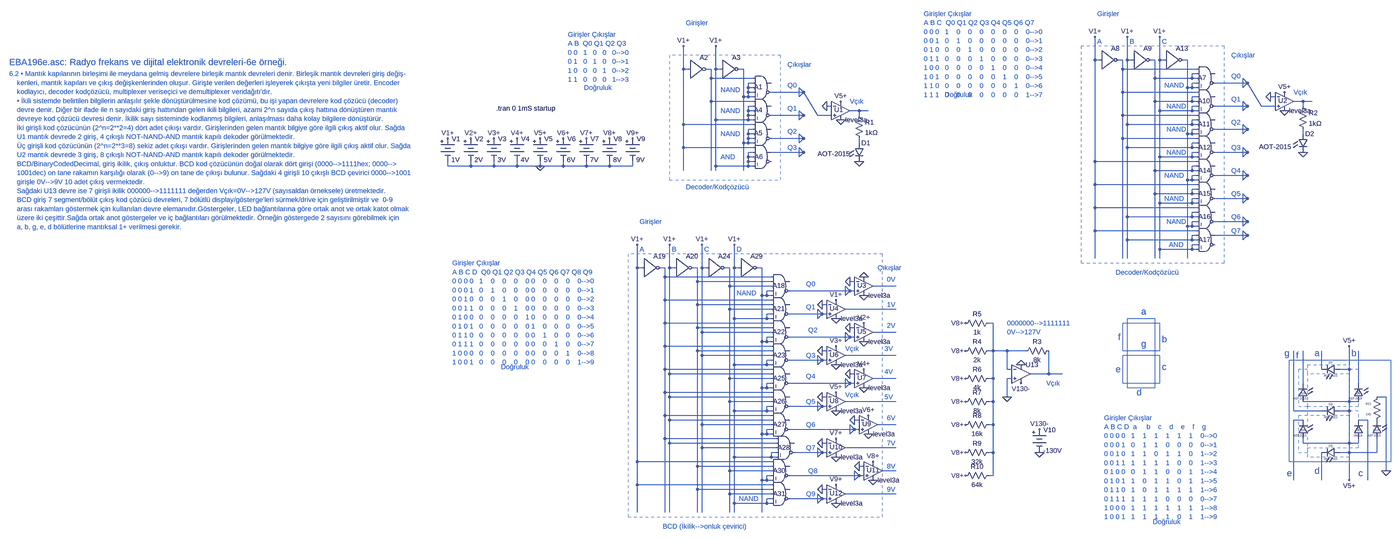
[diagram p0: schematic EBA196e.asc, whole sheet]
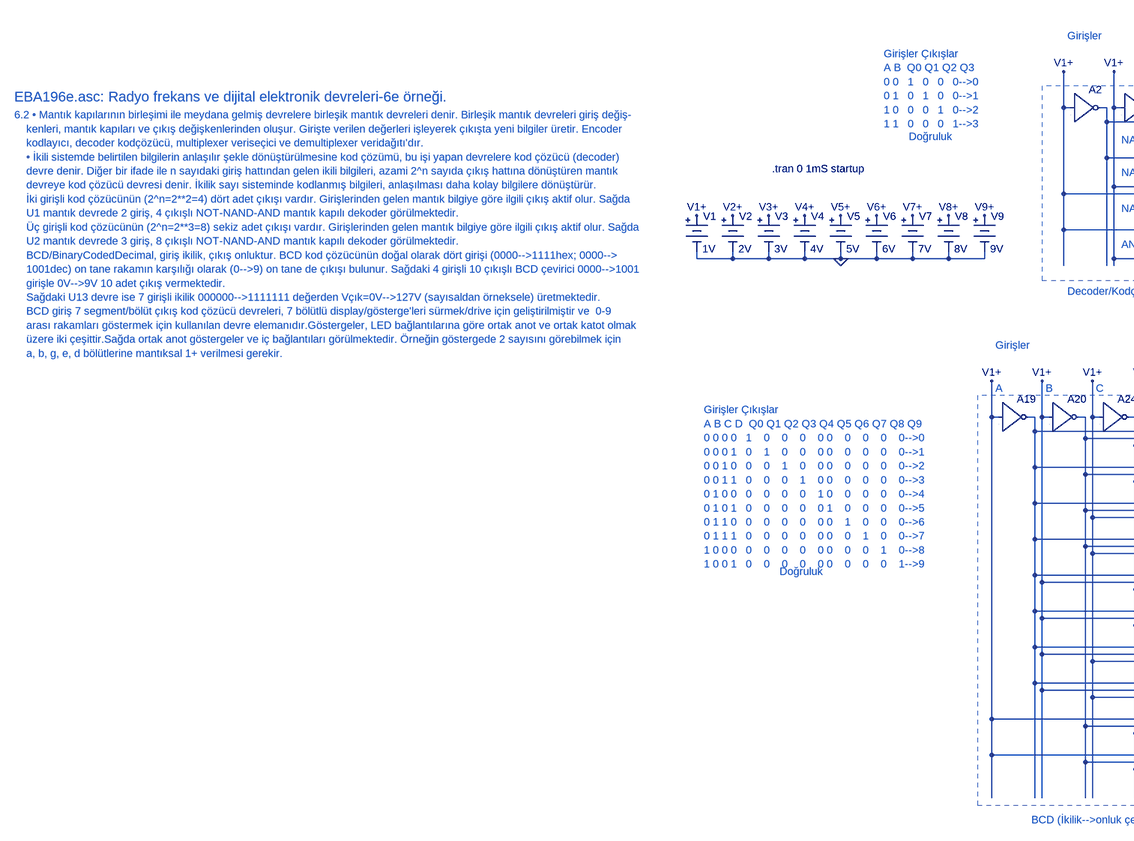
[diagram p1: schematic EBA196e.asc, part, row 1 of 1, column 1 of 2]
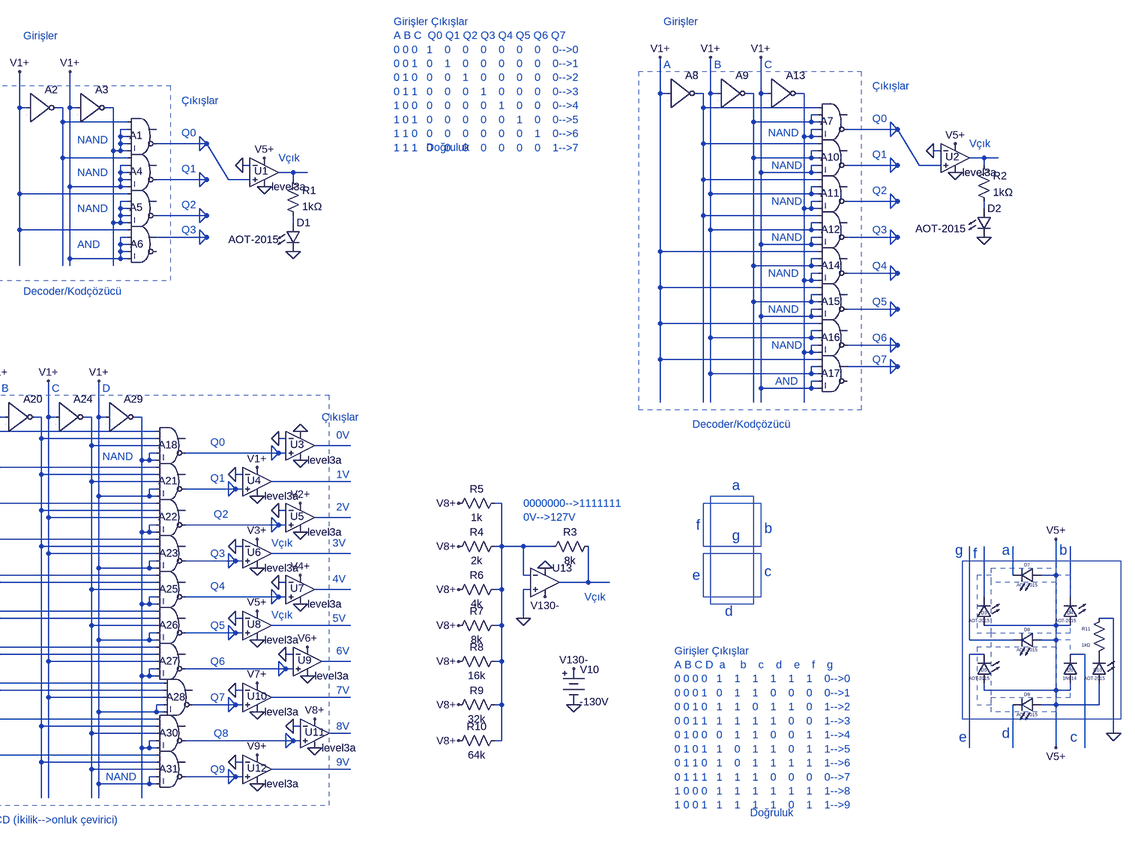
[diagram p2: schematic EBA196e.asc, part, row 1 of 1, column 2 of 2]
EBA196e.asc, the LTspice schematic file:
Version 4
SHEET 1 7064 4332
WIRE 3872 48 3872 -32
WIRE 3888 48 3872 48
WIRE 3968 48 3952 48
WIRE 3984 48 3984 -32
WIRE 4000 48 3984 48
WIRE 4080 48 4064 48
WIRE 4096 48 4096 -32
WIRE 4112 48 4096 48
WIRE 4192 48 4176 48
WIRE 2448 80 2448 0
WIRE 2464 80 2448 80
WIRE 2544 80 2528 80
WIRE 2560 80 2560 0
WIRE 2576 80 2560 80
WIRE 2656 80 2640 80
WIRE 3968 80 3968 48
WIRE 4224 80 3968 80
WIRE 4224 96 4208 96
WIRE 2544 112 2544 80
WIRE 2688 112 2544 112
WIRE 4080 112 4080 48
WIRE 4208 112 4208 96
WIRE 4208 112 4080 112
WIRE 4224 112 4208 112
WIRE 2688 128 2672 128
WIRE 4224 128 4208 128
WIRE 4400 128 4384 112
WIRE 4400 128 4288 128
WIRE 2672 144 2672 128
WIRE 2688 144 2672 144
WIRE 4192 144 4192 48
WIRE 4208 144 4208 128
WIRE 4208 144 4192 144
WIRE 4224 144 4208 144
WIRE 4384 144 4384 112
WIRE 4384 144 4400 128
WIRE 2672 160 2672 144
WIRE 2688 160 2672 160
WIRE 2864 160 2848 144
WIRE 2864 160 2752 160
WIRE 3968 160 3968 80
WIRE 4224 160 3968 160
WIRE 2656 176 2656 80
WIRE 2672 176 2672 160
WIRE 2672 176 2656 176
WIRE 2688 176 2672 176
WIRE 2848 176 2848 144
WIRE 2848 176 2864 160
WIRE 4224 176 4208 176
WIRE 4496 176 4480 176
WIRE 2544 192 2544 112
WIRE 2688 192 2544 192
WIRE 4080 192 4080 112
WIRE 4208 192 4208 176
WIRE 4208 192 4080 192
WIRE 4224 192 4208 192
WIRE 4592 192 4560 192
WIRE 4624 192 4592 192
WIRE 2688 208 2672 208
WIRE 2960 208 2944 208
WIRE 4224 208 4208 208
WIRE 4400 208 4384 192
WIRE 4400 208 4288 208
WIRE 4448 208 4400 128
WIRE 4496 208 4448 208
WIRE 4592 208 4592 192
WIRE 2672 224 2672 208
WIRE 2688 224 2672 224
WIRE 3056 224 3024 224
WIRE 3088 224 3056 224
WIRE 4096 224 4096 48
WIRE 4208 224 4208 208
WIRE 4208 224 4096 224
WIRE 4224 224 4208 224
WIRE 4384 224 4384 192
WIRE 4384 224 4400 208
WIRE 2672 240 2672 224
WIRE 2688 240 2672 240
WIRE 2864 240 2848 224
WIRE 2864 240 2752 240
WIRE 2912 240 2864 160
WIRE 2960 240 2912 240
WIRE 3056 240 3056 224
WIRE 3968 240 3968 160
WIRE 4224 240 3968 240
WIRE 2560 256 2560 80
WIRE 2672 256 2672 240
WIRE 2672 256 2560 256
WIRE 2688 256 2672 256
WIRE 2848 256 2848 224
WIRE 2848 256 2864 240
WIRE 4224 256 4208 256
WIRE 2448 272 2448 80
WIRE 2688 272 2448 272
WIRE 3984 272 3984 48
WIRE 4208 272 4208 256
WIRE 4208 272 3984 272
WIRE 4224 272 4208 272
WIRE 2688 288 2672 288
WIRE 4224 288 4208 288
WIRE 4400 288 4384 272
WIRE 4400 288 4288 288
WIRE 2672 304 2672 288
WIRE 2688 304 2672 304
WIRE 4192 304 4192 144
WIRE 4208 304 4208 288
WIRE 4208 304 4192 304
WIRE 4224 304 4208 304
WIRE 4384 304 4384 272
WIRE 4384 304 4400 288
WIRE 4592 304 4592 288
WIRE 2672 320 2672 304
WIRE 2688 320 2672 320
WIRE 2864 320 2848 304
WIRE 2864 320 2752 320
WIRE 3968 320 3968 240
WIRE 4224 320 3968 320
WIRE 2656 336 2656 176
WIRE 2672 336 2672 320
WIRE 2672 336 2656 336
WIRE 2688 336 2672 336
WIRE 2848 336 2848 304
WIRE 2848 336 2864 320
WIRE 3056 336 3056 320
WIRE 4224 336 4208 336
WIRE 2448 352 2448 272
WIRE 2688 352 2448 352
WIRE 3984 352 3984 272
WIRE 4208 352 4208 336
WIRE 4208 352 3984 352
WIRE 4224 352 4208 352
WIRE 2688 368 2672 368
WIRE 2864 368 2848 352
WIRE 2864 368 2752 368
WIRE 4224 368 4208 368
WIRE 4400 368 4384 352
WIRE 4400 368 4288 368
WIRE 2672 384 2672 368
WIRE 2688 384 2672 384
WIRE 2848 384 2848 352
WIRE 2848 384 2864 368
WIRE 4096 384 4096 224
WIRE 4208 384 4208 368
WIRE 4208 384 4096 384
WIRE 4224 384 4208 384
WIRE 4384 384 4384 352
WIRE 4384 384 4400 368
WIRE 2672 400 2672 384
WIRE 2688 400 2672 400
WIRE 3872 400 3872 48
WIRE 4224 400 3872 400
WIRE 1632 416 1632 400
WIRE 1712 416 1712 400
WIRE 1712 416 1632 416
WIRE 1792 416 1792 400
WIRE 1792 416 1712 416
WIRE 1872 416 1872 400
WIRE 1872 416 1792 416
WIRE 1952 416 1952 400
WIRE 1952 416 1872 416
WIRE 2032 416 2032 400
WIRE 2032 416 1952 416
WIRE 2112 416 2112 400
WIRE 2112 416 2032 416
WIRE 2192 416 2192 400
WIRE 2192 416 2112 416
WIRE 2272 416 2272 400
WIRE 2272 416 2192 416
WIRE 2560 416 2560 256
WIRE 2672 416 2672 400
WIRE 2672 416 2560 416
WIRE 2688 416 2672 416
WIRE 4224 416 4208 416
WIRE 2448 432 2448 352
WIRE 2544 432 2544 192
WIRE 2560 432 2560 416
WIRE 2656 432 2656 336
WIRE 4080 432 4080 192
WIRE 4208 432 4208 416
WIRE 4208 432 4080 432
WIRE 4224 432 4208 432
WIRE 4224 448 4208 448
WIRE 4400 448 4384 432
WIRE 4400 448 4288 448
WIRE 4192 464 4192 304
WIRE 4208 464 4208 448
WIRE 4208 464 4192 464
WIRE 4224 464 4208 464
WIRE 4384 464 4384 432
WIRE 4384 464 4400 448
WIRE 3872 480 3872 400
WIRE 4224 480 3872 480
WIRE 4224 496 4208 496
WIRE 4080 512 4080 432
WIRE 4208 512 4208 496
WIRE 4208 512 4080 512
WIRE 4224 512 4208 512
WIRE 4224 528 4208 528
WIRE 4400 528 4384 512
WIRE 4400 528 4288 528
WIRE 4096 544 4096 384
WIRE 4208 544 4208 528
WIRE 4208 544 4096 544
WIRE 4224 544 4208 544
WIRE 4384 544 4384 512
WIRE 4384 544 4400 528
WIRE 3872 560 3872 480
WIRE 4224 560 3872 560
WIRE 4224 576 4208 576
WIRE 3984 592 3984 352
WIRE 4208 592 4208 576
WIRE 4208 592 3984 592
WIRE 4224 592 4208 592
WIRE 4224 608 4208 608
WIRE 4400 608 4384 592
WIRE 4400 608 4288 608
WIRE 4192 624 4192 464
WIRE 4208 624 4208 608
WIRE 4208 624 4192 624
WIRE 4224 624 4208 624
WIRE 4384 624 4384 592
WIRE 4384 624 4400 608
WIRE 3872 640 3872 560
WIRE 4224 640 3872 640
WIRE 4224 656 4208 656
WIRE 4400 656 4384 640
WIRE 4400 656 4288 656
WIRE 3984 672 3984 592
WIRE 4208 672 4208 656
WIRE 4208 672 3984 672
WIRE 4224 672 4208 672
WIRE 4384 672 4384 640
WIRE 4384 672 4400 656
WIRE 4224 688 4208 688
WIRE 4096 704 4096 544
WIRE 4208 704 4208 688
WIRE 4208 704 4096 704
WIRE 4224 704 4208 704
WIRE 3872 736 3872 640
WIRE 3968 736 3968 320
WIRE 3984 736 3984 672
WIRE 4080 736 4080 512
WIRE 4096 736 4096 704
WIRE 4192 736 4192 624
WIRE 2288 768 2288 688
WIRE 2304 768 2288 768
WIRE 2384 768 2368 768
WIRE 2400 768 2400 688
WIRE 2416 768 2400 768
WIRE 2496 768 2480 768
WIRE 2512 768 2512 688
WIRE 2528 768 2512 768
WIRE 2608 768 2592 768
WIRE 2624 768 2624 688
WIRE 2640 768 2624 768
WIRE 2720 768 2704 768
WIRE 2384 800 2384 768
WIRE 2752 800 2384 800
WIRE 2496 816 2496 768
WIRE 2752 816 2496 816
WIRE 3040 816 3024 816
WIRE 2608 832 2608 768
WIRE 2752 832 2608 832
WIRE 3184 832 3104 832
WIRE 2752 848 2736 848
WIRE 3024 848 3008 832
WIRE 3024 848 2816 848
WIRE 3040 848 3024 848
WIRE 2720 864 2720 768
WIRE 2736 864 2736 848
WIRE 2736 864 2720 864
WIRE 2752 864 2736 864
WIRE 3008 864 3008 832
WIRE 3008 864 3024 848
WIRE 2384 880 2384 800
WIRE 2752 880 2384 880
WIRE 2496 896 2496 816
WIRE 2752 896 2496 896
WIRE 2944 896 2928 896
WIRE 2608 912 2608 832
WIRE 2752 912 2608 912
WIRE 3184 912 3008 912
WIRE 2752 928 2736 928
WIRE 2928 928 2912 912
WIRE 2928 928 2816 928
WIRE 2944 928 2928 928
WIRE 2624 944 2624 768
WIRE 2736 944 2736 928
WIRE 2736 944 2624 944
WIRE 2752 944 2736 944
WIRE 2912 944 2912 912
WIRE 2912 944 2928 928
WIRE 2384 960 2384 880
WIRE 2752 960 2384 960
WIRE 3520 960 3504 960
WIRE 2496 976 2496 896
WIRE 2752 976 2496 976
WIRE 3040 976 3024 976
WIRE 2512 992 2512 768
WIRE 2752 992 2512 992
WIRE 3184 992 3104 992
WIRE 2752 1008 2736 1008
WIRE 3024 1008 3008 992
WIRE 3024 1008 2816 1008
WIRE 3040 1008 3024 1008
WIRE 2720 1024 2720 864
WIRE 2736 1024 2736 1008
WIRE 2736 1024 2720 1024
WIRE 2752 1024 2736 1024
WIRE 3008 1024 3008 992
WIRE 3008 1024 3024 1008
WIRE 2384 1040 2384 960
WIRE 2752 1040 2384 1040
WIRE 2496 1056 2496 976
WIRE 2752 1056 2496 1056
WIRE 2944 1056 2928 1056
WIRE 3520 1056 3520 960
WIRE 3520 1056 3504 1056
WIRE 3568 1056 3520 1056
WIRE 3632 1056 3568 1056
WIRE 2512 1072 2512 992
WIRE 2752 1072 2512 1072
WIRE 3184 1072 3008 1072
WIRE 2752 1088 2736 1088
WIRE 2928 1088 2912 1072
WIRE 2928 1088 2816 1088
WIRE 2944 1088 2928 1088
WIRE 2624 1104 2624 944
WIRE 2736 1104 2736 1088
WIRE 2736 1104 2624 1104
WIRE 2752 1104 2736 1104
WIRE 2912 1104 2912 1072
WIRE 2912 1104 2928 1088
WIRE 2384 1120 2384 1040
WIRE 2752 1120 2384 1120
WIRE 3568 1120 3568 1056
WIRE 3584 1120 3568 1120
WIRE 4656 1120 4656 1056
WIRE 4752 1120 4752 1040
WIRE 4752 1120 4720 1120
WIRE 2400 1136 2400 768
WIRE 2752 1136 2400 1136
WIRE 3040 1136 3024 1136
WIRE 3712 1136 3712 1056
WIRE 3712 1136 3648 1136
WIRE 3760 1136 3712 1136
WIRE 2608 1152 2608 912
WIRE 2752 1152 2608 1152
WIRE 3184 1152 3104 1152
WIRE 3520 1152 3520 1056
WIRE 3520 1152 3504 1152
WIRE 3584 1152 3568 1152
WIRE 2752 1168 2736 1168
WIRE 3024 1168 3008 1152
WIRE 3024 1168 2816 1168
WIRE 3040 1168 3024 1168
WIRE 4592 1168 4592 1056
WIRE 4784 1168 4784 1056
WIRE 2720 1184 2720 1024
WIRE 2736 1184 2736 1168
WIRE 2736 1184 2720 1184
WIRE 2752 1184 2736 1184
WIRE 3008 1184 3008 1152
WIRE 3008 1184 3024 1168
WIRE 2384 1200 2384 1120
WIRE 2752 1200 2384 1200
WIRE 2400 1216 2400 1136
WIRE 2752 1216 2400 1216
WIRE 2944 1216 2928 1216
WIRE 3568 1216 3568 1152
WIRE 4880 1216 4848 1216
WIRE 2608 1232 2608 1152
WIRE 2752 1232 2608 1232
WIRE 3184 1232 3008 1232
WIRE 3520 1232 3520 1152
WIRE 3520 1232 3504 1232
WIRE 4752 1232 4752 1120
WIRE 4752 1232 4592 1232
WIRE 4784 1232 4752 1232
WIRE 2752 1248 2736 1248
WIRE 2928 1248 2912 1232
WIRE 2928 1248 2816 1248
WIRE 2944 1248 2928 1248
WIRE 2624 1264 2624 1104
WIRE 2736 1264 2736 1248
WIRE 2736 1264 2624 1264
WIRE 2752 1264 2736 1264
WIRE 2912 1264 2912 1232
WIRE 2912 1264 2928 1248
WIRE 4560 1264 4560 1056
WIRE 4656 1264 4560 1264
WIRE 4752 1264 4752 1232
WIRE 4752 1264 4720 1264
WIRE 2384 1280 2384 1200
WIRE 2752 1280 2384 1280
WIRE 2400 1296 2400 1216
WIRE 2752 1296 2400 1296
WIRE 3056 1296 3040 1296
WIRE 4592 1296 4560 1296
WIRE 4816 1296 4784 1296
WIRE 2512 1312 2512 1072
WIRE 2752 1312 2512 1312
WIRE 3184 1312 3120 1312
WIRE 3520 1312 3520 1232
WIRE 3520 1312 3504 1312
WIRE 2752 1328 2736 1328
WIRE 3040 1328 3024 1312
WIRE 3040 1328 2816 1328
WIRE 3056 1328 3040 1328
WIRE 2720 1344 2720 1184
WIRE 2736 1344 2736 1328
WIRE 2736 1344 2720 1344
WIRE 2752 1344 2736 1344
WIRE 3024 1344 3024 1312
WIRE 3024 1344 3040 1328
WIRE 2384 1360 2384 1280
WIRE 2768 1360 2384 1360
WIRE 2400 1376 2400 1296
WIRE 2768 1376 2400 1376
WIRE 2944 1376 2928 1376
WIRE 4592 1376 4592 1360
WIRE 4752 1376 4752 1264
WIRE 4752 1376 4592 1376
WIRE 4784 1376 4784 1360
WIRE 4784 1376 4752 1376
WIRE 2512 1392 2512 1312
WIRE 2768 1392 2512 1392
WIRE 3184 1392 3008 1392
WIRE 2768 1408 2752 1408
WIRE 2928 1408 2912 1392
WIRE 2928 1408 2832 1408
WIRE 2944 1408 2928 1408
WIRE 3520 1408 3520 1312
WIRE 3520 1408 3504 1408
WIRE 4752 1408 4752 1376
WIRE 4752 1408 4720 1408
WIRE 4848 1408 4848 1360
WIRE 4848 1408 4752 1408
WIRE 2624 1424 2624 1264
WIRE 2752 1424 2752 1408
WIRE 2752 1424 2624 1424
WIRE 2768 1424 2752 1424
WIRE 2912 1424 2912 1392
WIRE 2912 1424 2928 1408
WIRE 2288 1440 2288 768
WIRE 2752 1440 2288 1440
WIRE 2496 1456 2496 1056
WIRE 2752 1456 2496 1456
WIRE 3072 1456 3056 1456
WIRE 2608 1472 2608 1232
WIRE 2752 1472 2608 1472
WIRE 3184 1472 3136 1472
WIRE 4880 1472 4880 1216
WIRE 2752 1488 2736 1488
WIRE 3056 1488 3040 1472
WIRE 3056 1488 2816 1488
WIRE 3072 1488 3056 1488
WIRE 3520 1488 3520 1408
WIRE 3520 1488 3504 1488
WIRE 2720 1504 2720 1344
WIRE 2736 1504 2736 1488
WIRE 2736 1504 2720 1504
WIRE 2752 1504 2736 1504
WIRE 3040 1504 3040 1472
WIRE 3040 1504 3056 1488
WIRE 4560 1504 4560 1296
WIRE 4656 1504 4656 1408
WIRE 4752 1504 4752 1408
WIRE 4816 1504 4816 1296
WIRE 2288 1520 2288 1440
WIRE 2752 1520 2288 1520
WIRE 2496 1536 2496 1456
WIRE 2752 1536 2496 1536
WIRE 2944 1536 2928 1536
WIRE 2608 1552 2608 1472
WIRE 2752 1552 2608 1552
WIRE 3184 1552 3008 1552
WIRE 2752 1568 2736 1568
WIRE 2928 1568 2912 1552
WIRE 2928 1568 2816 1568
WIRE 2944 1568 2928 1568
WIRE 2624 1584 2624 1424
WIRE 2736 1584 2736 1568
WIRE 2736 1584 2624 1584
WIRE 2752 1584 2736 1584
WIRE 2912 1584 2912 1552
WIRE 2912 1584 2928 1568
WIRE 2288 1616 2288 1520
WIRE 2384 1616 2384 1360
WIRE 2400 1616 2400 1376
WIRE 2496 1616 2496 1536
WIRE 2512 1616 2512 1392
WIRE 2608 1616 2608 1552
WIRE 2624 1616 2624 1584
WIRE 2720 1616 2720 1504
FLAG 2448 0 V1+
FLAG 2560 0 V1+
FLAG 2944 208 0
FLAG 2992 192 V5+
FLAG 2992 256 0
FLAG 3056 400 0
FLAG 3872 -32 V1+
FLAG 3984 -32 V1+
FLAG 4480 176 0
FLAG 4528 160 V5+
FLAG 4528 224 0
FLAG 4592 368 0
FLAG 4096 -32 V1+
FLAG 2288 688 V1+
FLAG 2400 688 V1+
FLAG 3024 816 0
FLAG 3072 864 0
FLAG 2512 688 V1+
FLAG 2624 688 V1+
FLAG 1632 320 V1+
FLAG 1712 320 V2+
FLAG 1792 320 V3+
FLAG 1872 320 V4+
FLAG 1952 320 V5+
FLAG 2032 320 V6+
FLAG 2112 320 V7+
FLAG 2192 320 V8+
FLAG 2272 320 V9+
FLAG 1952 416 0
FLAG 2928 896 0
FLAG 2976 944 0
FLAG 3024 976 0
FLAG 3072 1024 0
FLAG 2928 1056 0
FLAG 2976 1104 0
FLAG 3024 1136 0
FLAG 3072 1184 0
FLAG 2928 1216 0
FLAG 2976 1264 0
FLAG 3040 1296 0
FLAG 3088 1344 0
FLAG 2928 1376 0
FLAG 2976 1424 0
FLAG 3056 1456 0
FLAG 3104 1504 0
FLAG 2928 1536 0
FLAG 2976 1584 0
FLAG 3072 800 0
FLAG 2976 880 V1+
FLAG 3072 960 V2+
FLAG 2976 1040 V3+
FLAG 3072 1120 V4+
FLAG 2976 1200 V5+
FLAG 3088 1280 V6+
FLAG 2976 1360 V7+
FLAG 3104 1440 V8+
FLAG 2976 1520 V9+
FLAG 3568 1216 0
FLAG 3424 960 V8+
FLAG 3424 1056 V8+
FLAG 3424 1152 V8+
FLAG 3424 1232 V8+
FLAG 3424 1312 V8+
FLAG 3424 1408 V8+
FLAG 3424 1488 V8+
FLAG 3616 1104 0
FLAG 3680 1328 V130-
FLAG 3680 1408 0
FLAG 3616 1168 V130-
FLAG 4752 1040 V5+
FLAG 4752 1504 V5+
FLAG 4880 1472 0
SYMBOL Digital\\and 2720 80 R0
WINDOW 0 -28 62 Left 2
SYMATTR InstName A1
SYMBOL Digital\\inv 2464 16 R0
SYMATTR InstName A2
SYMBOL Digital\\inv 2576 16 R0
SYMATTR InstName A3
SYMBOL Digital\\and 2720 160 R0
WINDOW 0 -28 62 Left 2
SYMATTR InstName A4
SYMBOL Digital\\and 2720 240 R0
WINDOW 0 -28 62 Left 2
SYMATTR InstName A5
SYMBOL Digital\\and 2720 320 R0
WINDOW 0 -26 63 Left 2
SYMATTR InstName A6
SYMBOL OpAmps\\UniversalOpAmp3 2992 224 R0
WINDOW 0 -22 -3 Left 2
SYMATTR InstName U1
SYMBOL LED 3040 336 R0
WINDOW 3 -128 37 Left 2
SYMATTR Value AOT-2015
SYMATTR InstName D1
SYMATTR Description Diode
SYMATTR Type diode
SYMBOL res 3040 224 R0
SYMATTR InstName R1
SYMATTR Value 1kΩ
SYMBOL Digital\\and 4256 48 R0
WINDOW 0 -28 62 Left 2
SYMATTR InstName A7
SYMBOL Digital\\inv 3888 -16 R0
SYMATTR InstName A8
SYMBOL Digital\\inv 4000 -16 R0
SYMATTR InstName A9
SYMBOL Digital\\and 4256 128 R0
WINDOW 0 -28 62 Left 2
SYMATTR InstName A10
SYMBOL Digital\\and 4256 208 R0
WINDOW 0 -28 62 Left 2
SYMATTR InstName A11
SYMBOL Digital\\and 4256 288 R0
WINDOW 0 -26 63 Left 2
SYMATTR InstName A12
SYMBOL OpAmps\\UniversalOpAmp3 4528 192 R0
WINDOW 0 -22 -3 Left 2
SYMATTR InstName U2
SYMBOL LED 4576 304 R0
WINDOW 3 -136 45 Left 2
SYMATTR Value AOT-2015
SYMATTR InstName D2
SYMATTR Description Diode
SYMATTR Type diode
SYMBOL res 4576 192 R0
SYMATTR InstName R2
SYMATTR Value 1kΩ
SYMBOL Digital\\inv 4112 -16 R0
SYMATTR InstName A13
SYMBOL Digital\\and 4256 368 R0
WINDOW 0 -26 63 Left 2
SYMATTR InstName A14
SYMBOL Digital\\and 4256 448 R0
WINDOW 0 -26 63 Left 2
SYMATTR InstName A15
SYMBOL Digital\\and 4256 528 R0
WINDOW 0 -26 63 Left 2
SYMATTR InstName A16
SYMBOL Digital\\and 4256 608 R0
WINDOW 0 -26 63 Left 2
SYMATTR InstName A17
SYMBOL Digital\\and 2784 768 R0
WINDOW 0 -28 62 Left 2
SYMATTR InstName A18
SYMBOL Digital\\inv 2304 704 R0
SYMATTR InstName A19
SYMBOL Digital\\inv 2416 704 R0
SYMATTR InstName A20
SYMBOL Digital\\and 2784 848 R0
WINDOW 0 -28 62 Left 2
SYMATTR InstName A21
SYMBOL Digital\\and 2784 928 R0
WINDOW 0 -28 62 Left 2
SYMATTR InstName A22
SYMBOL Digital\\and 2784 1008 R0
WINDOW 0 -26 63 Left 2
SYMATTR InstName A23
SYMBOL OpAmps\\UniversalOpAmp3 3072 832 R0
WINDOW 0 -22 -3 Left 2
SYMATTR InstName U3
SYMBOL Digital\\inv 2528 704 R0
SYMATTR InstName A24
SYMBOL Digital\\and 2784 1088 R0
WINDOW 0 -26 63 Left 2
SYMATTR InstName A25
SYMBOL Digital\\and 2784 1168 R0
WINDOW 0 -26 63 Left 2
SYMATTR InstName A26
SYMBOL Digital\\and 2784 1248 R0
WINDOW 0 -26 63 Left 2
SYMATTR InstName A27
SYMBOL Digital\\and 2800 1328 R0
WINDOW 0 -26 63 Left 2
SYMATTR InstName A28
SYMBOL Digital\\inv 2640 704 R0
SYMATTR InstName A29
SYMBOL Digital\\and 2784 1408 R0
WINDOW 0 -26 63 Left 2
SYMATTR InstName A30
SYMBOL Digital\\and 2784 1488 R0
WINDOW 0 -26 63 Left 2
SYMATTR InstName A31
SYMBOL Misc\\battery 1632 304 R0
WINDOW 0 14 18 Left 2
WINDOW 3 13 90 Left 2
SYMATTR InstName V1
SYMATTR Value 1V
SYMBOL Misc\\battery 1712 304 R0
WINDOW 0 14 18 Left 2
WINDOW 3 13 90 Left 2
WINDOW 123 0 0 Left 0
WINDOW 39 0 0 Left 0
SYMATTR InstName V2
SYMATTR Value 2V
SYMBOL Misc\\battery 1792 304 R0
WINDOW 0 14 18 Left 2
WINDOW 3 13 90 Left 2
SYMATTR InstName V3
SYMATTR Value 3V
SYMBOL Misc\\battery 1872 304 R0
WINDOW 0 14 18 Left 2
WINDOW 3 13 90 Left 2
SYMATTR InstName V4
SYMATTR Value 4V
SYMBOL Misc\\battery 1952 304 R0
WINDOW 0 14 18 Left 2
WINDOW 3 13 90 Left 2
SYMATTR InstName V5
SYMATTR Value 5V
SYMBOL Misc\\battery 2032 304 R0
WINDOW 0 14 18 Left 2
WINDOW 3 13 90 Left 2
SYMATTR InstName V6
SYMATTR Value 6V
SYMBOL Misc\\battery 2112 304 R0
WINDOW 0 14 18 Left 2
WINDOW 3 13 90 Left 2
SYMATTR InstName V7
SYMATTR Value 7V
SYMBOL Misc\\battery 2192 304 R0
WINDOW 0 14 18 Left 2
WINDOW 3 13 90 Left 2
SYMATTR InstName V8
SYMATTR Value 8V
SYMBOL Misc\\battery 2272 304 R0
WINDOW 0 14 18 Left 2
WINDOW 3 13 90 Left 2
SYMATTR InstName V9
SYMATTR Value 9V
SYMBOL OpAmps\\UniversalOpAmp3 2976 912 R0
WINDOW 0 -22 -3 Left 2
SYMATTR InstName U4
SYMBOL OpAmps\\UniversalOpAmp3 3072 992 R0
WINDOW 0 -22 -3 Left 2
SYMATTR InstName U5
SYMBOL OpAmps\\UniversalOpAmp3 2976 1072 R0
WINDOW 0 -22 -3 Left 2
SYMATTR InstName U6
SYMBOL OpAmps\\UniversalOpAmp3 3072 1152 R0
WINDOW 0 -22 -3 Left 2
SYMATTR InstName U7
SYMBOL OpAmps\\UniversalOpAmp3 2976 1232 R0
WINDOW 0 -22 -3 Left 2
SYMATTR InstName U8
SYMBOL OpAmps\\UniversalOpAmp3 3088 1312 R0
WINDOW 0 -22 -3 Left 2
SYMATTR InstName U9
SYMBOL OpAmps\\UniversalOpAmp3 2976 1392 R0
WINDOW 0 -22 -3 Left 2
SYMATTR InstName U10
SYMBOL OpAmps\\UniversalOpAmp3 3104 1472 R0
WINDOW 0 -22 -3 Left 2
SYMATTR InstName U11
SYMBOL OpAmps\\UniversalOpAmp3 2976 1552 R0
WINDOW 0 -22 -3 Left 2
SYMATTR InstName U12
SYMBOL res 3728 1040 R90
WINDOW 0 0 56 VBottom 2
WINDOW 3 32 56 VTop 2
SYMATTR InstName R3
SYMATTR Value 8k
SYMBOL res 3520 1040 R90
WINDOW 0 0 56 VBottom 2
WINDOW 3 32 56 VTop 2
SYMATTR InstName R4
SYMATTR Value 2k
SYMBOL res 3520 944 R90
WINDOW 0 0 56 VBottom 2
WINDOW 3 32 56 VTop 2
SYMATTR InstName R5
SYMATTR Value 1k
SYMBOL res 3520 1136 R90
WINDOW 0 0 56 VBottom 2
WINDOW 3 32 56 VTop 2
SYMATTR InstName R6
SYMATTR Value 4k
SYMBOL Opamps\\UniversalOpamp2 3616 1136 R0
SYMATTR InstName U13
SYMBOL res 3520 1216 R90
WINDOW 0 0 56 VBottom 2
WINDOW 3 32 56 VTop 2
SYMATTR InstName R7
SYMATTR Value 8k
SYMBOL res 3520 1296 R90
WINDOW 0 0 56 VBottom 2
WINDOW 3 32 56 VTop 2
SYMATTR InstName R8
SYMATTR Value 16k
SYMBOL res 3520 1392 R90
WINDOW 0 0 56 VBottom 2
WINDOW 3 32 56 VTop 2
SYMATTR InstName R9
SYMATTR Value 32k
SYMBOL res 3520 1472 R90
WINDOW 0 0 56 VBottom 2
WINDOW 3 32 56 VTop 2
SYMATTR InstName R10
SYMATTR Value 64k
SYMBOL Misc\\battery 3680 1312 R0
WINDOW 0 14 18 Left 2
WINDOW 3 13 90 Left 2
SYMATTR InstName V10
SYMATTR Value -130V
SYMBOL LED 4608 1232 R180
WINDOW 0 10 28 Left 0
WINDOW 3 3 10 Left 0
SYMATTR InstName D3
SYMATTR Value AOT-2015
SYMATTR Description Diode
SYMATTR Type diode
SYMBOL LED 4800 1232 R180
WINDOW 0 10 28 Left 0
WINDOW 3 3 10 Left 0
SYMATTR InstName D4
SYMATTR Value AOT-2015
SYMATTR Description Diode
SYMATTR Type diode
SYMBOL LED 4608 1360 R180
WINDOW 0 10 28 Left 0
WINDOW 3 3 10 Left 0
SYMATTR InstName D5
SYMATTR Value AOT-2015
SYMATTR Description Diode
SYMATTR Type diode
SYMBOL diode 4800 1360 R180
WINDOW 0 10 28 Left 0
WINDOW 3 3 10 Left 0
SYMATTR InstName D6
SYMATTR Value 1N914
SYMBOL LED 4720 1136 M270
WINDOW 0 32 32 VTop 0
WINDOW 3 0 32 VBottom 0
SYMATTR InstName D7
SYMATTR Value AOT-2015
SYMATTR Description Diode
SYMATTR Type diode
SYMBOL LED 4720 1280 M270
WINDOW 0 32 32 VTop 0
WINDOW 3 0 32 VBottom 0
SYMATTR InstName D8
SYMATTR Value AOT-2015
SYMATTR Description Diode
SYMATTR Type diode
SYMBOL LED 4720 1424 M270
WINDOW 0 32 32 VTop 0
WINDOW 3 0 32 VBottom 0
SYMATTR InstName D9
SYMATTR Value AOT-2015
SYMATTR Description Diode
SYMATTR Type diode
SYMBOL LED 4864 1360 R180
WINDOW 0 10 28 Left 0
WINDOW 3 3 10 Left 0
SYMATTR InstName D10
SYMATTR Value AOT-2015
SYMATTR Description Diode
SYMATTR Type diode
SYMBOL res 4864 1200 M0
WINDOW 0 36 40 Left 0
WINDOW 3 36 76 Left 0
SYMATTR InstName R11
SYMATTR Value 1kΩ
TEXT -232 56 Left 3 ;EBA196e.asc: Radyo frekans ve dijital elektronik devreleri-6e örneği.
TEXT -232 96 Left 2 ;6.2 • Mantık kapılarının birleşimi ile meydana gelmiş devrelere birleşik mantık devreleri denir. Birleşik mantık devreleri giriş değiş-\n    kenleri, mantık kapıları ve çıkış değişkenlerinden oluşur. Girişte verilen değerleri işleyerek çıkışta yeni bilgiler üretir. Encoder \n    kodlayıcı, decoder kodçözücü, multiplexer veriseçici ve demultiplexer veridağıtı'dır.\n    • İkili sistemde belirtilen bilgilerin anlaşılır şekle dönüştürülmesine kod çözümü, bu işi yapan devrelere kod çözücü (decoder) \n    devre denir. Diğer bir ifade ile n sayıdaki giriş hattından gelen ikili bilgileri, azami 2^n sayıda çıkış hattına dönüştüren mantık \n    devreye kod çözücü devresi denir. İkilik sayı sisteminde kodlanmış bilgileri, anlaşılması daha kolay bilgilere dönüştürür.\n    İki girişli kod çözücünün (2^n=2**2=4) dört adet çıkışı vardır. Girişlerinden gelen mantık bilgiye göre ilgili çıkış aktif olur. Sağda\n    U1 mantık devrede 2 giriş, 4 çıkışlı NOT-NAND-AND mantık kapılı dekoder görülmektedir.\n    Üç girişli kod çözücünün (2^n=2**3=8) sekiz adet çıkışı vardır. Girişlerinden gelen mantık bilgiye göre ilgili çıkış aktif olur. Sağda\n    U2 mantık devrede 3 giriş, 8 çıkışlı NOT-NAND-AND mantık kapılı dekoder görülmektedir.\n    BCD/BinaryCodedDecimal, giriş ikilik, çıkış onluktur. BCD kod çözücünün doğal olarak dört girişi (0000-->1111hex; 0000-->\n    1001dec) on tane rakamın karşılığı olarak (0-->9) on tane de çıkışı bulunur. Sağdaki 4 girişli 10 çıkışlı BCD çevirici 0000-->1001\n    girişle 0V-->9V 10 adet çıkış vermektedir.\n    Sağdaki U13 devre ise 7 girişli ikilik 000000-->1111111 değerden Vçık=0V-->127V (sayısaldan örneksele) üretmektedir.\n    BCD giriş 7 segment/bölüt çıkış kod çözücü devreleri, 7 bölütlü display/gösterge'leri sürmek/drive için geliştirilmiştir ve  0-9 \n    arası rakamları göstermek için kullanılan devre elemanıdır.Göstergeler, LED bağlantılarına göre ortak anot ve ortak katot olmak\n    üzere iki çeşittir.Sağda ortak anot göstergeler ve iç bağlantıları görülmektedir. Örneğin göstergede 2 sayısını görebilmek için \n    a, b, g, e, d bölütlerine mantıksal 1+ verilmesi gerekir.
TEXT 1800 216 Left 2 !.tran 0 1mS startup
TEXT 2048 -40 Left 2 ;Girişler Çıkışlar\nA B  Q0 Q1 Q2 Q3\n0 0   1   0   0   0-->0\n0 1   0   1   0   0-->1\n1 0   0   0   1   0-->2\n1 1   0   0   0   1-->3
TEXT 2808 296 Left 2 ;Q2
TEXT 2808 216 Left 2 ;Q1
TEXT 2808 136 Left 2 ;Q0
TEXT 2808 352 Left 2 ;Q3
TEXT 2576 152 Left 2 ;NAND
TEXT 2576 224 Left 2 ;NAND
TEXT 2576 304 Left 2 ;NAND
TEXT 2576 384 Left 2 ;AND
TEXT 2456 488 Left 2 ;Decoder/Kodçözücü
TEXT 2456 -80 Left 2 ;Girişler
TEXT 2808 64 Left 2 ;Çıkışlar
TEXT 3024 192 Left 2 ;Vçık
TEXT 3280 -112 Left 2 ;Girişler Çıkışlar\nA B C  Q0 Q1 Q2 Q3 Q4 Q5 Q6 Q7\n0 0 0   1    0    0    0    0    0    0    0-->0\n0 0 1   0    1    0    0    0    0    0    0-->1\n0 1 0   0    0    1    0    0    0    0    0-->2\n0 1 1   0    0    0    1    0    0    0    0-->3\n1 0 0   0    0    0    0    1    0    0    0-->4\n1 0 1   0    0    0    0    0    1    0    0-->5\n1 1 0   0    0    0    0    0    0    1    0-->6\n1 1 1   0    0    0    0    0    0    0    1-->7
TEXT 4344 264 Left 2 ;Q2
TEXT 4344 184 Left 2 ;Q1
TEXT 4344 104 Left 2 ;Q0
TEXT 4344 352 Left 2 ;Q3
TEXT 3944 784 Left 2 ;Decoder/Kodçözücü
TEXT 3880 -112 Left 2 ;Girişler
TEXT 4344 32 Left 2 ;Çıkışlar
TEXT 4560 160 Left 2 ;Vçık
TEXT 2104 144 Left 2 ;Doğruluk
TEXT 3352 168 Left 2 ;Doğruluk
TEXT 3880 -16 Left 2 ;A
TEXT 3992 -16 Left 2 ;B
TEXT 4104 -16 Left 2 ;C
TEXT 4344 432 Left 2 ;Q4
TEXT 4344 512 Left 2 ;Q5
TEXT 4344 592 Left 2 ;Q6
TEXT 4344 640 Left 2 ;Q7
TEXT 4112 136 Left 2 ;NAND
TEXT 4128 688 Left 2 ;AND
TEXT 4120 208 Left 2 ;NAND
TEXT 4120 288 Left 2 ;NAND
TEXT 4120 368 Left 2 ;NAND
TEXT 4112 448 Left 2 ;NAND
TEXT 4112 528 Left 2 ;NAND
TEXT 4120 608 Left 2 ;NAND
TEXT 1648 752 Left 2 ;Girişler Çıkışlar\nA B C D  Q0 Q1 Q2 Q3 Q4 Q5 Q6 Q7 Q8 Q9\n0 0 0 0   1    0    0    0    0 0    0    0    0    0-->0\n0 0 0 1   0    1    0    0    0 0    0    0    0    0-->1\n0 0 1 0   0    0    1    0    0 0    0    0    0    0-->2\n0 0 1 1   0    0    0    1    0 0    0    0    0    0-->3\n0 1 0 0   0    0    0    0    1 0    0    0    0    0-->4\n0 1 0 1   0    0    0    0    0 1    0    0    0    0-->5\n0 1 1 0   0    0    0    0    0 0    1    0    0    0-->6\n0 1 1 1   0    0    0    0    0 0    0    1    0    0-->7\n1 0 0 0   0    0    0    0    0 0    0    0    1    0-->8\n1 0 0 1   0    0    0    0    0 0    0    0    0    1-->9
TEXT 2880 984 Left 2 ;Q2
TEXT 2872 904 Left 2 ;Q1
TEXT 2872 824 Left 2 ;Q0
TEXT 2872 1072 Left 2 ;Q3
TEXT 2376 1664 Left 2 ;BCD (İkilik-->onluk çevirici)
TEXT 2296 608 Left 2 ;Girişler
TEXT 3120 768 Left 2 ;Çıkışlar
TEXT 1816 1112 Left 2 ;Doğruluk
TEXT 2296 704 Left 2 ;A
TEXT 2408 704 Left 2 ;B
TEXT 2520 704 Left 2 ;C
TEXT 2872 1144 Left 2 ;Q4
TEXT 2872 1232 Left 2 ;Q5
TEXT 2872 1312 Left 2 ;Q6
TEXT 2872 1392 Left 2 ;Q7
TEXT 2632 704 Left 2 ;D
TEXT 2632 856 Left 2 ;NAND
TEXT 2880 1472 Left 2 ;Q8
TEXT 2872 1552 Left 2 ;Q9
TEXT 3008 1048 Left 2 ;Vçık
TEXT 3008 1208 Left 2 ;Vçık
TEXT 2640 1568 Left 2 ;NAND
TEXT 3152 808 Left 2 ;0V
TEXT 3152 896 Left 2 ;1V
TEXT 3152 968 Left 2 ;2V
TEXT 3144 1048 Left 2 ;3V
TEXT 3144 1128 Left 2 ;4V
TEXT 3144 1216 Left 2 ;5V
TEXT 3152 1288 Left 2 ;6V
TEXT 3152 1376 Left 2 ;7V
TEXT 3152 1456 Left 2 ;8V
TEXT 3152 1536 Left 2 ;9V
TEXT 3704 1168 Left 2 ;Vçık
TEXT 3568 960 Left 2 ;0000000-->1111111\n0V-->127V
TEXT 4536 1480 Left 3 ;e
TEXT 4632 1472 Left 3 ;d
TEXT 4784 1480 Left 3 ;c
TEXT 4528 1064 Left 3 ;g
TEXT 4568 1072 Left 3 ;f
TEXT 4632 1064 Left 3 ;a
TEXT 4760 1064 Left 3 ;b
TEXT 4032 920 Left 3 ;a
TEXT 4104 1016 Left 3 ;b
TEXT 4104 1112 Left 3 ;c
TEXT 4016 1200 Left 3 ;d
TEXT 3944 1120 Left 3 ;e
TEXT 3952 1008 Left 3 ;f
TEXT 4032 1032 Left 3 ;g
TEXT 3904 1288 Left 2 ;Girişler Çıkışlar\nA B C D  a     b    c    d    e    f    g\n0 0 0 0   1    1    1    1    1    1    0-->0\n0 0 0 1   0    1    1    0    0    0    0-->1\n0 0 1 0   1    1    0    1    1    0    1-->2\n0 0 1 1   1    1    1    1    0    0    1-->3\n0 1 0 0   0    1    1    0    0    1    1-->4\n0 1 0 1   1    0    1    1    0    1    1-->5\n0 1 1 0   1    0    1    1    1    1    1-->6\n0 1 1 1   1    1    1    0    0    0    0-->7\n1 0 0 0   1    1    1    1    1    1    1-->8\n1 0 0 1   1    1    1    1    0    1    1-->9
TEXT 4072 1648 Left 2 ;Doğruluk
RECTANGLE Normal 2784 32 2400 464 2
RECTANGLE Normal 4320 0 3824 752 2
RECTANGLE Normal 3136 720 2256 1632 2
RECTANGLE Normal 4752 1280 4608 1248 2
RECTANGLE Normal 4752 1424 4608 1392 2
RECTANGLE Normal 4752 1136 4608 1104 2
RECTANGLE Normal 4576 1408 4608 1280 2
RECTANGLE Normal 4576 1248 4608 1120 2
RECTANGLE Normal 4752 1248 4784 1120 2
RECTANGLE Normal 4752 1392 4784 1264 2
RECTANGLE Normal 4896 1088 4544 1440
RECTANGLE Normal 4080 960 3984 944
RECTANGLE Normal 4080 1056 4096 960
RECTANGLE Normal 3968 1056 3984 960
RECTANGLE Normal 4080 1072 3984 1056
RECTANGLE Normal 4080 1168 4096 1072
RECTANGLE Normal 3968 1168 3984 1072
RECTANGLE Normal 4080 1184 3984 1168

The netlist it stands for:
* EBA196e.asc
A1 N004 N005 N005 N005 N005 N007 0 0 AND
A2 V1+ 0 0 0 0 N004 0 0 BUF
A3 V1+ 0 0 0 0 N005 0 0 BUF
A4 N004 V1+ V1+ V1+ V1+ N011 0 0 AND
A5 V1+ N005 N005 N005 N005 N014 0 0 AND
A6 V1+ V1+ V1+ V1+ V1+ 0 N016 0 AND
XU1 N007 0 V5+ 0 N010 level3a  ; pins In+ In- V+ V- OUT
D1 N015 0 AOT-2015
R1 N010 N015 1kΩ
A7 N001 N002 N002 N003 N003 N006 0 0 AND
A8 V1+ 0 0 0 0 N001 0 0 BUF
A9 V1+ 0 0 0 0 N002 0 0 BUF
A10 N001 N002 N002 V1+ V1+ N009 0 0 AND
A11 N001 V1+ V1+ N003 N003 N012 0 0 AND
A12 N001 V1+ V1+ V1+ V1+ N017 0 0 AND
XU2 N006 0 V5+ 0 N008 level3a  ; pins In+ In- V+ V- OUT
D2 N013 0 AOT-2015
R2 N008 N013 1kΩ
A13 V1+ 0 0 0 0 N003 0 0 BUF
A14 V1+ N002 N002 N003 N003 N018 0 0 AND
A15 V1+ N002 N002 V1+ V1+ N019 0 0 AND
A16 V1+ V1+ V1+ N003 N003 N020 0 0 AND
A17 V1+ V1+ V1+ V1+ V1+ 0 N021 0 AND
A18 N022 N023 N024 N025 N025 N027 0 0 AND
A19 V1+ 0 0 0 0 N022 0 0 BUF
A20 V1+ 0 0 0 0 N023 0 0 BUF
A21 N022 N023 N024 V1+ V1+ N029 0 0 AND
A22 N022 N023 V1+ N025 N025 N032 0 0 AND
A23 N022 N023 V1+ V1+ V1+ N034 0 0 AND
XU3 N027 0 0 0 N026 level3a  ; pins In+ In- V+ V- OUT
A24 V1+ 0 0 0 0 N024 0 0 BUF
A25 N022 V1+ N024 N025 N025 N038 0 0 AND
A26 N022 V1+ N024 V1+ V1+ N042 0 0 AND
A27 N022 V1+ V1+ N025 N025 N047 0 0 AND
A28 N022 V1+ V1+ V1+ V1+ N049 0 0 AND
A29 V1+ 0 0 0 0 N025 0 0 BUF
A30 V1+ N023 N024 N025 N025 N051 0 0 AND
A31 V1+ N023 N024 V1+ V1+ N054 0 0 AND
V1 V1+ 0 1V
V2 V2+ 0 2V
V3 V3+ 0 3V
V4 V4+ 0 4V
V5 V5+ 0 5V
V6 V6+ 0 6V
V7 V7+ 0 7V
V8 V8+ 0 8V
V9 V9+ 0 9V
XU4 N029 0 V1+ 0 N028 level3a  ; pins In+ In- V+ V- OUT
XU5 N032 0 V2+ 0 N031 level3a  ; pins In+ In- V+ V- OUT
XU6 N034 0 V3+ 0 N033 level3a  ; pins In+ In- V+ V- OUT
XU7 N038 0 V4+ 0 N037 level3a  ; pins In+ In- V+ V- OUT
XU8 N042 0 V5+ 0 N041 level3a  ; pins In+ In- V+ V- OUT
XU9 N047 0 V6+ 0 N046 level3a  ; pins In+ In- V+ V- OUT
XU10 N049 0 V7+ 0 N048 level3a  ; pins In+ In- V+ V- OUT
XU11 N051 0 V8+ 0 N050 level3a  ; pins In+ In- V+ V- OUT
XU12 N054 0 V9+ 0 N053 level3a  ; pins In+ In- V+ V- OUT
R3 N036 N030 8k
R4 N030 V8+ 2k
R5 N030 V8+ 1k
R6 N030 V8+ 4k
XU13 0 N030 0 V130- N036 level.2 Avol=1Meg GBW=10Meg Slew=10Meg ilimit=25m rail=0 Vos=0 phimargin=45 en=0 enk=0 in=0 ink=0 Rin=500Meg  ; pins IN+ IN- V+ V- OUT
R7 N030 V8+ 8k
R8 N030 V8+ 16k
R9 N030 V8+ 32k
R10 N030 V8+ 64k
V10 V130- 0 -130V
D3 V5+ N039 AOT-2015
D4 V5+ N040 AOT-2015
D5 V5+ N044 AOT-2015
D6 V5+ N045 1N914
D7 V5+ N035 AOT-2015
D8 V5+ N043 AOT-2015
D9 V5+ N052 AOT-2015
D10 V5+ P001 AOT-2015
R11 0 P001 1kΩ
.model D D
.lib standard.dio
* EBA196e.asc: Radyo frekans ve dijital elektronik devreleri-6e örneği.
* 6.2 • Mantık kapılarının birleşimi ile meydana gelmiş devrelere birleşik mantık devreleri denir. Birleşik mantık devreleri giriş değiş-
*     kenleri, mantık kapıları ve çıkış değişkenlerinden oluşur. Girişte verilen değerleri işleyerek çıkışta yeni bilgiler üretir. Encoder
*     kodlayıcı, decoder kodçözücü, multiplexer veriseçici ve demultiplexer veridağıtı'dır.
*     • İkili sistemde belirtilen bilgilerin anlaşılır şekle dönüştürülmesine kod çözümü, bu işi yapan devrelere kod çözücü (decoder)
*     devre denir. Diğer bir ifade ile n sayıdaki giriş hattından gelen ikili bilgileri, azami 2^n sayıda çıkış hattına dönüştüren mantık
*     devreye kod çözücü devresi denir. İkilik sayı sisteminde kodlanmış bilgileri, anlaşılması daha kolay bilgilere dönüştürür.
*     İki girişli kod çözücünün (2^n=2**2=4) dört adet çıkışı vardır. Girişlerinden gelen mantık bilgiye göre ilgili çıkış aktif olur. Sağda
*     U1 mantık devrede 2 giriş, 4 çıkışlı NOT-NAND-AND mantık kapılı dekoder görülmektedir.
*     Üç girişli kod çözücünün (2^n=2**3=8) sekiz adet çıkışı vardır. Girişlerinden gelen mantık bilgiye göre ilgili çıkış aktif olur. Sağda
*     U2 mantık devrede 3 giriş, 8 çıkışlı NOT-NAND-AND mantık kapılı dekoder görülmektedir.
*     BCD/BinaryCodedDecimal, giriş ikilik, çıkış onluktur. BCD kod çözücünün doğal olarak dört girişi (0000-->1111hex; 0000-->
*     1001dec) on tane rakamın karşılığı olarak (0-->9) on tane de çıkışı bulunur. Sağdaki 4 girişli 10 çıkışlı BCD çevirici 0000-->1001
*     girişle 0V-->9V 10 adet çıkış vermektedir.
*     Sağdaki U13 devre ise 7 girişli ikilik 000000-->1111111 değerden Vçık=0V-->127V (sayısaldan örneksele) üretmektedir.
*     BCD giriş 7 segment/bölüt çıkış kod çözücü devreleri, 7 bölütlü display/gösterge'leri sürmek/drive için geliştirilmiştir ve  0-9
*     arası rakamları göstermek için kullanılan devre elemanıdır.Göstergeler, LED bağlantılarına göre ortak anot ve ortak katot olmak
*     üzere iki çeşittir.Sağda ortak anot göstergeler ve iç bağlantıları görülmektedir. Örneğin göstergede 2 sayısını görebilmek için
*     a, b, g, e, d bölütlerine mantıksal 1+ verilmesi gerekir.
.tran 0 1mS startup
* Girişler Çıkışlar
* A B  Q0 Q1 Q2 Q3
* 0 0   1   0   0   0-->0
* 0 1   0   1   0   0-->1
* 1 0   0   0   1   0-->2
* 1 1   0   0   0   1-->3
* Q2
* Q1
* Q0
* Q3
* NAND
* NAND
* NAND
* AND
* Decoder/Kodçözücü
* Girişler
* Çıkışlar
* Vçık
* Girişler Çıkışlar
* A B C  Q0 Q1 Q2 Q3 Q4 Q5 Q6 Q7
* 0 0 0   1    0    0    0    0    0    0    0-->0
* 0 0 1   0    1    0    0    0    0    0    0-->1
* 0 1 0   0    0    1    0    0    0    0    0-->2
* 0 1 1   0    0    0    1    0    0    0    0-->3
* 1 0 0   0    0    0    0    1    0    0    0-->4
* 1 0 1   0    0    0    0    0    1    0    0-->5
* 1 1 0   0    0    0    0    0    0    1    0-->6
* 1 1 1   0    0    0    0    0    0    0    1-->7
* Q2
* Q1
* Q0
* Q3
* Decoder/Kodçözücü
* Girişler
* Çıkışlar
* Vçık
* Doğruluk
* Doğruluk
* A
* B
* C
* Q4
* Q5
* Q6
* Q7
* NAND
* AND
* NAND
* NAND
* NAND
* NAND
* NAND
* NAND
* Girişler Çıkışlar
* A B C D  Q0 Q1 Q2 Q3 Q4 Q5 Q6 Q7 Q8 Q9
* 0 0 0 0   1    0    0    0    0 0    0    0    0    0-->0
* 0 0 0 1   0    1    0    0    0 0    0    0    0    0-->1
* 0 0 1 0   0    0    1    0    0 0    0    0    0    0-->2
* 0 0 1 1   0    0    0    1    0 0    0    0    0    0-->3
* 0 1 0 0   0    0    0    0    1 0    0    0    0    0-->4
* 0 1 0 1   0    0    0    0    0 1    0    0    0    0-->5
* 0 1 1 0   0    0    0    0    0 0    1    0    0    0-->6
* 0 1 1 1   0    0    0    0    0 0    0    1    0    0-->7
* 1 0 0 0   0    0    0    0    0 0    0    0    1    0-->8
* 1 0 0 1   0    0    0    0    0 0    0    0    0    1-->9
* Q2
* Q1
* Q0
* Q3
* BCD (İkilik-->onluk çevirici)
* Girişler
* Çıkışlar
* Doğruluk
* A
* B
* C
* Q4
* Q5
* Q6
* Q7
* D
* NAND
* Q8
* Q9
* Vçık
* Vçık
* NAND
* 0V
* 1V
* 2V
* 3V
* 4V
* 5V
* 6V
* 7V
* 8V
* 9V
* Vçık
* 0000000-->1111111
* 0V-->127V
* e
* d
* c
* g
* f
* a
* b
* a
* b
* c
* d
* e
* f
* g
* Girişler Çıkışlar
* A B C D  a     b    c    d    e    f    g
* 0 0 0 0   1    1    1    1    1    1    0-->0
* 0 0 0 1   0    1    1    0    0    0    0-->1
* 0 0 1 0   1    1    0    1    1    0    1-->2
* 0 0 1 1   1    1    1    1    0    0    1-->3
* 0 1 0 0   0    1    1    0    0    1    1-->4
* 0 1 0 1   1    0    1    1    0    1    1-->5
* 0 1 1 0   1    0    1    1    1    1    1-->6
* 0 1 1 1   1    1    1    0    0    0    0-->7
* 1 0 0 0   1    1    1    1    1    1    1-->8
* 1 0 0 1   1    1    1    1    0    1    1-->9
* Doğruluk
.lib UniversalOpamps2.sub
.backanno
.end